# Altium schematic sheet [01] - CPU.SchDoc
size A3
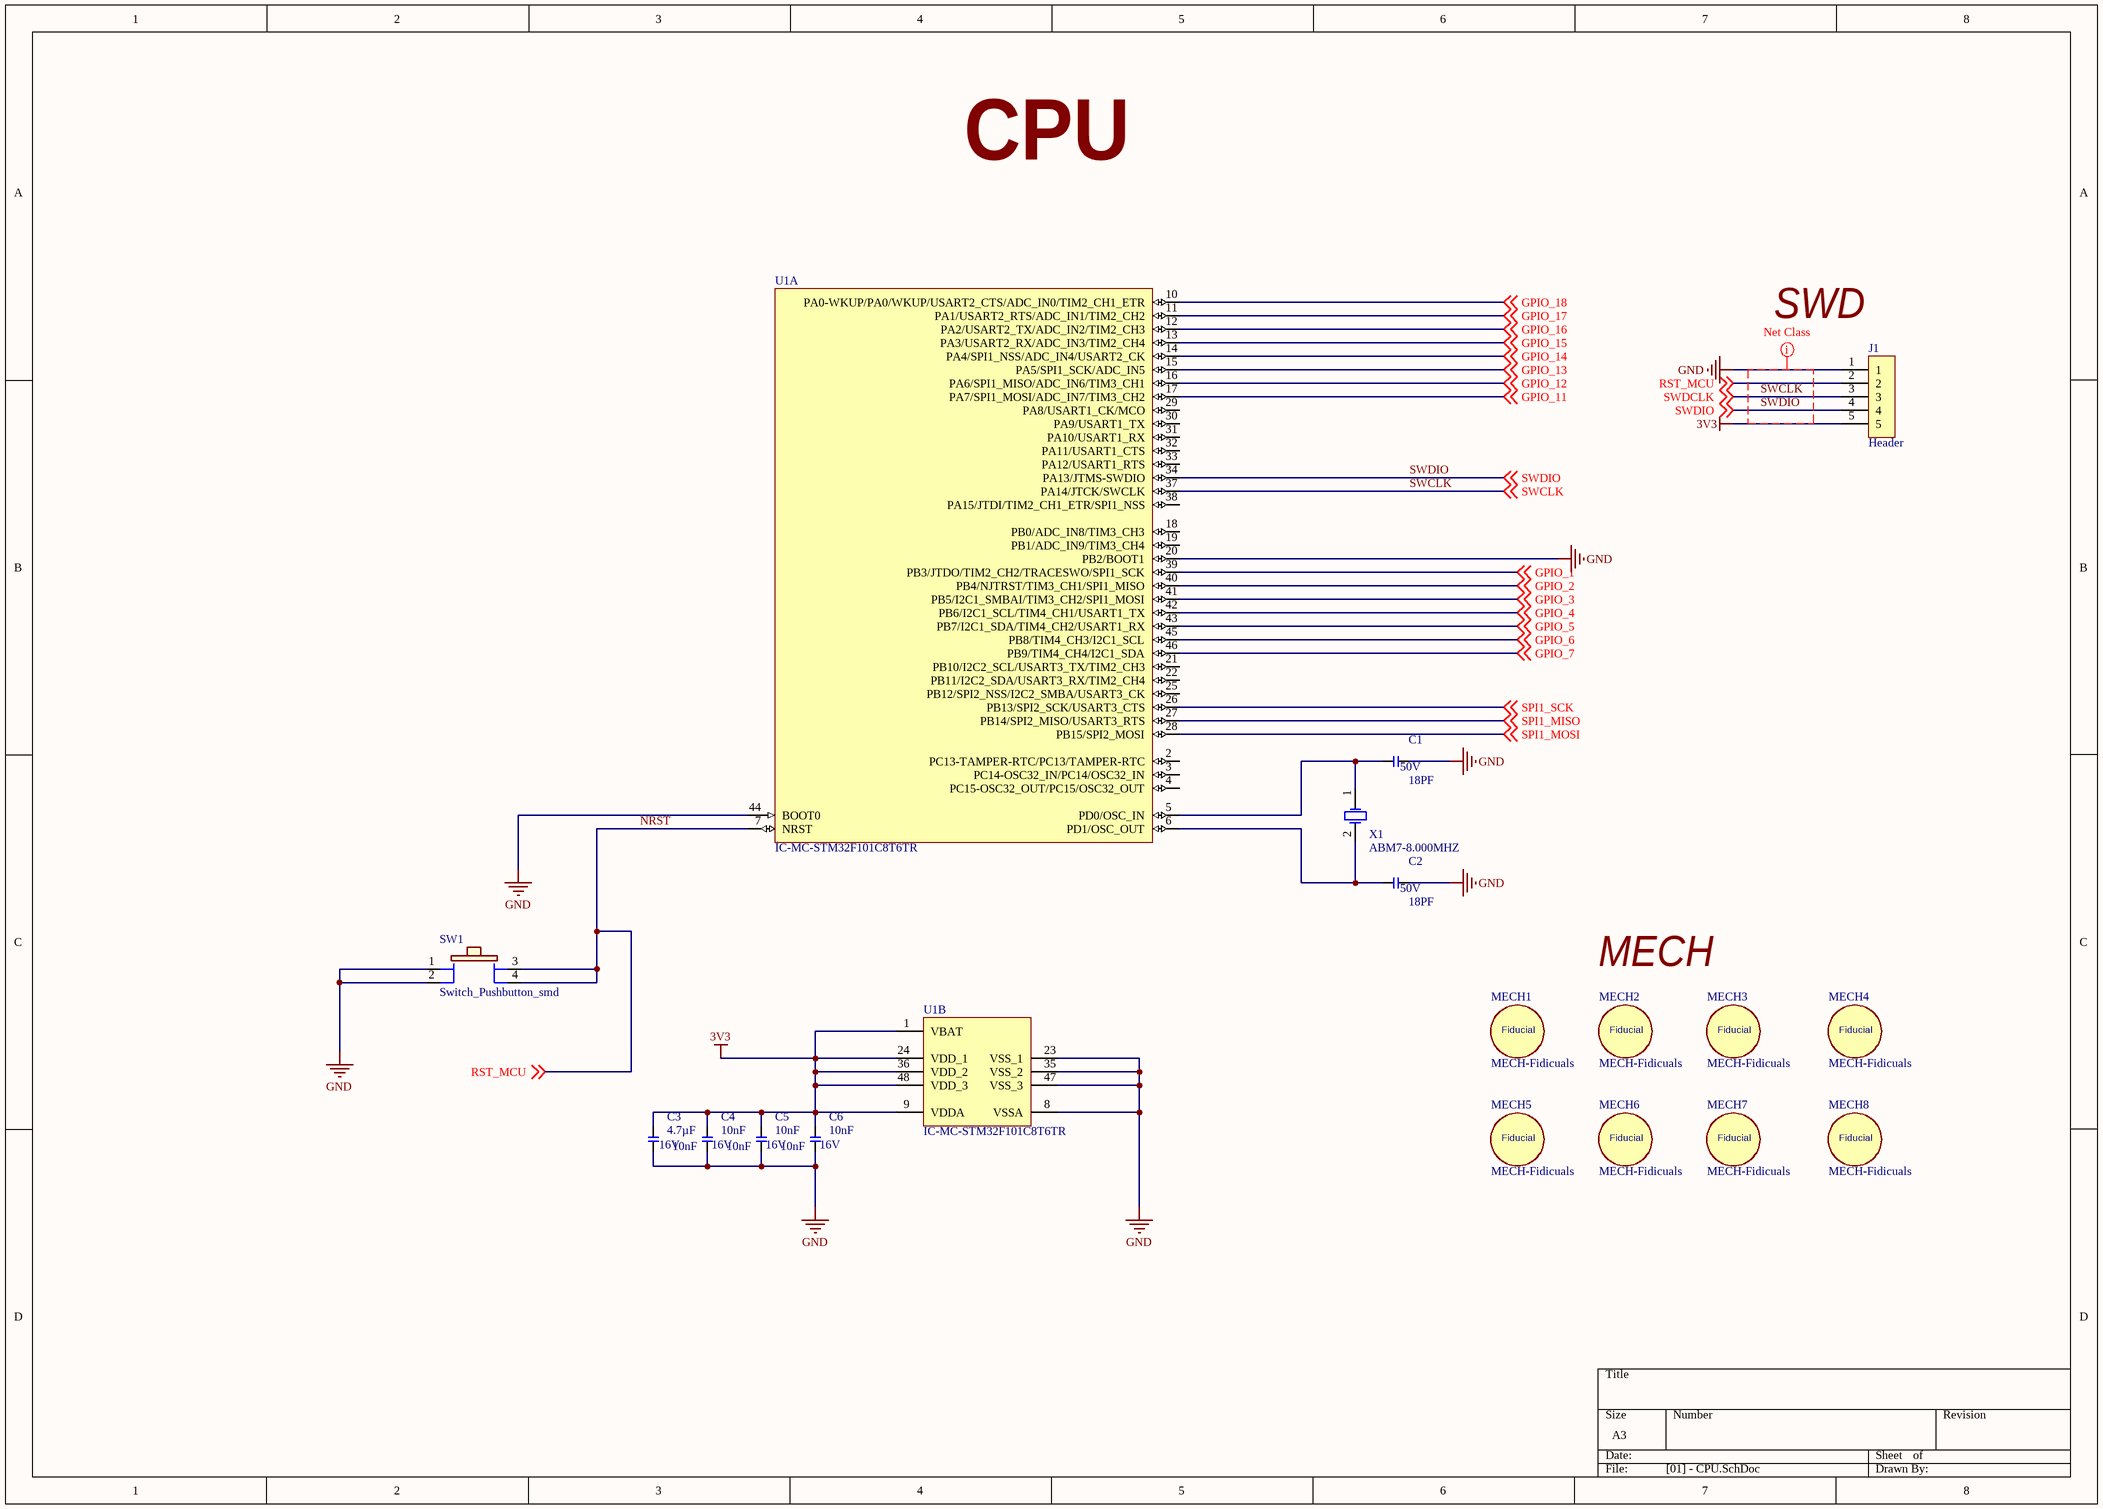
[diagram p0: [01] - CPU.SchDoc]

## Parts
C1  18PF  voltage_rating_dc: 50V  [C0805]
C2  18PF  voltage_rating_dc: 50V  [C0805]
C3  4.7µF  Voltage - Rated: 16V  [C0805]
C4  10nF  Voltage - Rated: 16V  [C0805]
C5  10nF  Voltage - Rated: 16V  [C0805]
C6  10nF  Voltage - Rated: 16V  [C0805]
J1  Header  [Header 1x5 2.54mm]
MECH1  MECH-Fidicuals  [T-Fidicuals]
MECH2  MECH-Fidicuals  [T-Fidicuals]
MECH3  MECH-Fidicuals  [T-Fidicuals]
MECH4  MECH-Fidicuals  [T-Fidicuals]
MECH5  MECH-Fidicuals  [T-Fidicuals]
MECH6  MECH-Fidicuals  [T-Fidicuals]
MECH7  MECH-Fidicuals  [T-Fidicuals]
MECH8  MECH-Fidicuals  [T-Fidicuals]
SW1  Switch_Pushbutton_smd  [SW_B3SL-1022P]
U1  IC-MC-STM32F101C8T6TR  [STM-LQFP48_M]  (parts A,B of 2)
X1  ABM7-8.000MHZ  [sm_osc_mixed]

## Nets
3V3: C3.2 C4.2 C5.2 C6.2 J1.5 U1.1(VBAT) U1.9(VDDA) U1.24(VDD_1) U1.36(VDD_2) U1.48(VDD_3)
GND: C1.2 C2.2 C3.1 C4.1 C5.1 C6.1 J1.1 SW1.1 SW1.2 U1.8(VSSA) U1.20(PB2/BOOT1) U1.23(VSS_1) U1.35(VSS_2) U1.44(BOOT0) U1.47(VSS_3)
GPIO_1: U1.39(PB3/JTDO/TIM2_CH2/TRACESWO/SPI1_SCK) ; off-sheet GPIO_1
GPIO_2: U1.40(PB4/NJTRST/TIM3_CH1/SPI1_MISO) ; off-sheet GPIO_2
GPIO_3: U1.41(PB5/I2C1_SMBAI/TIM3_CH2/SPI1_MOSI) ; off-sheet GPIO_3
GPIO_4: U1.42(PB6/I2C1_SCL/TIM4_CH1/USART1_TX) ; off-sheet GPIO_4
GPIO_5: U1.43(PB7/I2C1_SDA/TIM4_CH2/USART1_RX) ; off-sheet GPIO_5
GPIO_6: U1.45(PB8/TIM4_CH3/I2C1_SCL) ; off-sheet GPIO_6
GPIO_7: U1.46(PB9/TIM4_CH4/I2C1_SDA) ; off-sheet GPIO_7
GPIO_11: U1.17(PA7/SPI1_MOSI/ADC_IN7/TIM3_CH2) ; off-sheet GPIO_11
GPIO_12: U1.16(PA6/SPI1_MISO/ADC_IN6/TIM3_CH1) ; off-sheet GPIO_12
GPIO_13: U1.15(PA5/SPI1_SCK/ADC_IN5) ; off-sheet GPIO_13
GPIO_14: U1.14(PA4/SPI1_NSS/ADC_IN4/USART2_CK) ; off-sheet GPIO_14
GPIO_15: U1.13(PA3/USART2_RX/ADC_IN3/TIM2_CH4) ; off-sheet GPIO_15
GPIO_16: U1.12(PA2/USART2_TX/ADC_IN2/TIM2_CH3) ; off-sheet GPIO_16
GPIO_17: U1.11(PA1/USART2_RTS/ADC_IN1/TIM2_CH2) ; off-sheet GPIO_17
GPIO_18: U1.10(PA0-WKUP/PA0/WKUP/USART2_CTS/ADC_IN0/TIM2_CH1_ETR) ; off-sheet GPIO_18
NRST: J1.2 SW1.3 SW1.4 U1.7(NRST) ; off-sheet RST_MCU  [also labelled RST_MCU]
SPI1_MISO: U1.27(PB14/SPI2_MISO/USART3_RTS) ; off-sheet SPI1_MISO
SPI1_MOSI: U1.28(PB15/SPI2_MOSI) ; off-sheet SPI1_MOSI
SPI1_SCK: U1.26(PB13/SPI2_SCK/USART3_CTS) ; off-sheet SPI1_SCK
SWCLK: J1.3 U1.37(PA14/JTCK/SWCLK) ; off-sheet SWCLK, off-sheet SWDCLK  [also labelled SWDCLK]
SWDIO: J1.4 U1.34(PA13/JTMS-SWDIO) ; off-sheet SWDIO
NetC1_1: C1.1 U1.5(PD0/OSC_IN) X1.1(OSC1)
NetC2_1: C2.1 U1.6(PD1/OSC_OUT) X1.2(OSC2)

Not connected (* = marked no-connect by the designer): U1 2(PC13-TAMPER-RTC/PC13/TAMPER-RTC) 3(PC14-OSC32_IN/PC14/OSC32_IN) 4(PC15-OSC32_OUT/PC15/OSC32_OUT) 18(PB0/ADC_IN8/TIM3_CH3) 19(PB1/ADC_IN9/TIM3_CH4) 21(PB10/I2C2_SCL/USART3_TX/TIM2_CH3) 22(PB11/I2C2_SDA/USART3_RX/TIM2_CH4) 25(PB12/SPI2_NSS/I2C2_SMBA/USART3_CK) 29(PA8/USART1_CK/MCO) 30(PA9/USART1_TX) 31(PA10/USART1_RX) 32(PA11/USART1_CTS) 33(PA12/USART1_RTS) 38(PA15/JTDI/TIM2_CH1_ETR/SPI1_NSS)

## Layout directives
net class SWD: GND

## Notes on the sheet
- CPU
- (near J1) SWD
- MECH
- (in symbol MECH-Fidicuals) Fiducial

## Library data of the parts
C1 C2 = C-18PF,50V,0805: MULTICOMP - MC0805N180J500CT - CAP, MLCC, C0G/NP0, 18PF, 50V,0805, REEL; capacitance_tolerance: ±5%; pin_count: 2; Supplier 1: Octopart; Manufacturer: Multicomp; Manufacturer Part Number: MC0805N180J500CT; Pricing 1: 1=0.11400, 10=0.07300, 50=0.04100, 100=0.03200, 250=0.02600, 500=0.02200, 1000=0.01800 (USD); capacitance: 18PF; ComponentLink1URL: http://datasheet.octopart.com/MC0805N180J500CT-Multicomp-datasheet-16478625.pdf; ComponentLink1Description: http://datasheet.octopart.com/MC0805N180J500CT-Multicomp-datasheet-16478625.pdf; Supplier Part Number 1: Newark - 06R4039; Stock 1: 3187; reach_svhc_compliance: No SVHC; rohs_status: Compliant; dielectric_characteristic: C0G/NP0; Octopart Url: http://octopart.com/mc0805n180j500ct-multicomp-10529169; Seller Landing  Url: https://octopart-clicks.com/click/track?country=TR&ak=8157f166&sig=03c9fd1&sid=2402&ppid=10529169&vpid=17760821&ct=offers; OctopartID: 811748bd0de05ed0; ComponentLink2URL: http://datasheet.octopart.com/MC0805N180J500CT-Multicomp-datasheet-22150886.pdf; ComponentLink2Description: http://datasheet.octopart.com/MC0805N180J500CT-Multicomp-datasheet-22150886.pdf; ComponentLink3URL: http://datasheet.octopart.com/MC0805N180J500CT-Multicomp-datasheet-8445804.pdf; ComponentLink3Description: http://datasheet.octopart.com/MC0805N180J500CT-Multicomp-datasheet-8445804.pdf; ComponentLink4URL: http://datasheet.octopart.com/MC0805N180J500CT-Multicomp-datasheet-34215986.pdf; ComponentLink4Description: http://datasheet.octopart.com/MC0805N180J500CT-Multicomp-datasheet-34215986.pdf; ComponentLink5URL: http://datasheet.octopart.com/MC0805N180J500CT-Multicomp-datasheet-26590290.pdf; ComponentLink5Description: http://datasheet.octopart.com/MC0805N180J500CT-Multicomp-datasheet-26590290.pdf; ComponentLink6URL: http://datasheet.octopart.com/MC0805N180J500CT-Multicomp-datasheet-15500401.pdf; ComponentLink6Description: http://datasheet.octopart.com/MC0805N180J500CT-Multicomp-datasheet-15500401.pdf; ComponentLink7URL: http://datasheet.octopart.com/MC0805N180J500CT-Multicomp-datasheet-10838970.pdf; ComponentLink7Description: http://datasheet.octopart.com/MC0805N180J500CT-Multicomp-datasheet-10838970.pdf
C3 = C-4.7UF,16V,0805: AVX - 0805YC475KAT2A - CAP, MLCC, X7R, 4.7UF, 16V, 0805; Manufacturer: AVX Corporation; Tolerance: ±10%; Supplier 1: Digi-Key; Manufacturer Part Number: 0805YC475KAT2A; RoHS: RoHS Compliant; Stock 1: 16611; Pricing 1: 1=0.78, 10=0.578, 25=0.4952, 50=0.462, 100=0.396, 250=0.363, 500=0.3135, 1000=0.264 (USD); Capacitance: 4.7µF; Packaging: Cut Tape (CT); ComponentLink1URL: http://datasheets.avx.com/X7RDielectric.pdf; ComponentLink1Description: http://datasheets.avx.com/X7RDielectric.pdf; Supplier Part Number 1: 478-5722-1-ND; Category: Capacitors; Temperature Coefficient: X7R; Mounting Type: Surface Mount, MLCC; Operating Temperature: -55°C ~ 125°C; Applications: General Purpose; Ratings: -; Package / Case: 0805 (2012 Metric); Size / Dimension: 0.079" L x 0.049" W (2.01mm x 1.25mm); Height - Seated (Max): -; Thickness (Max): 0.060" (1.52mm); Lead Spacing: -; Features: -; Lead Style: -
C4-C6 = C-10NF,16V,0805: CAP CER 10000PF 16V NP0 0805; Manufacturer: AVX Corporation; Manufacturer Part Number: 0805YA103JAT2A; Tolerance: ±5%; Temperature Coefficient: C0G, NP0; Supplier 1: Digi-Key; RoHS: RoHS Compliant; Stock 1: 28062; Pricing 1: 1=0.29, 10=0.204, 25=0.1668, 50=0.1424, 100=0.1221, 250=0.10176, 500=0.09158, 1000=0.07733 (USD); ComponentLink1URL: http://datasheets.avx.com/C0GNP0-Dielectric.pdf; ComponentLink1Description: http://datasheets.avx.com/C0GNP0-Dielectric.pdf; Supplier Part Number 1: 478-1334-1-ND; Category: Capacitors; Packaging: Cut Tape (CT); Mounting Type: Surface Mount, MLCC; Operating Temperature: -55°C ~ 125°C; Applications: General Purpose; Ratings: -; Package / Case: 0805 (2012 Metric); Size / Dimension: 0.079" L x 0.049" W (2.01mm x 1.25mm); Height - Seated (Max): -; Thickness (Max): 0.037" (0.94mm); Lead Spacing: -; Features: -; Lead Style: -; Capacitance: 10nF
J1 = CON-Header 1X5 2.54MM: Header 1X5 2.54
MECH1-MECH8 = MECH-Fidicuals: Fidicuals
SW1 = Switch_Pushbutton_smd: Switch Push Button tactile; TIIntPartnumber: 2W0018; MfrNum: B3SL-1022P; Mfr: Omron; PartName: SwitchPushMomTactilesmd; Cost10K: 0.25; Cost100: 0.340; Vendor: Digikey; DescriptiveText: Switch Push Button tactile; Descriptive_Text: Switch Push Button tactile
U1 = IC-MC-STM32F101C8T6TR: IC MCU 32BIT 64KB FLASH 48LQFP; Manufacturer: STMicroelectronics; Program Memory Size: 64KB (64K x 8); Core Processor: ARM® Cortex®-M3; Core Size: 32-Bit; Speed: 36MHz; Connectivity: I²C, IrDA, LIN, SPI, UART/USART; Peripherals: DMA, PDR, POR, PVD, PWM, Temp Sensor, WDT; Number of I/O: 37; RAM Size: 10K x 8; Voltage - Supply (Vcc/Vdd): 2 V ~ 3.6 V; Data Converters: A/D 10x12b; Oscillator Type: Internal; Supplier 1: Digi-Key; Manufacturer Part Number: STM32F101C8T6TR; RoHS: RoHS Compliant; Category: Integrated Circuits (ICs); Stock 1: 0; Pricing 1: 2400=2.46449 (USD); Packaging: Tape & Reel (TR); Program Memory Type: FLASH; ComponentLink1URL: http://www.st.com/content/ccc/resource/technical/document/datasheet/6b/28/4e/ce/a7/d3/42/8d/CD00161561.pdf/files/CD00161561.pdf/jcr:content/translations/en.CD00161561.pdf; ComponentLink1Description: http://www.st.com/content/ccc/resource/technical/document/datasheet/6b/28/4e/ce/a7/d3/42/8d/CD00161561.pdf/files/CD00161561.pdf/jcr:content/translations/en.CD00161561.pdf; Supplier Part Number 1: STM32F101C8T6TR-ND; EEPROM Size: -; Operating Temperature: -40°C ~ 85°C (TA); Package / Case: 48-LQFP; Supplier Device Package: 48-LQFP (7x7)
X1 = OSC-ABM7-8.000MHZ-D2Y-T: CRYSTAL 8.0000MHZ 18PF SMD; Manufacturer: Abracon LLC; Frequency: 8MHz; Frequency Stability: ±30ppm; Frequency Tolerance: ±20ppm; ESR (Equivalent Series Resistance): 100 Ohm; Operating Mode: Fundamental; Supplier 1: Digi-Key; Manufacturer Part Number: ABM7-8.000MHZ-D2Y-T; RoHS: RoHS Compliant; Category: Crystals and Oscillators; Stock 1: 111842; Pricing 1: 1=0.76, 10=0.678, 50=0.6328, 100=0.56, 500=0.5292 (USD); Packaging: Cut Tape (CT); Type: MHz Crystal; Load Capacitance: 18pF; Operating Temperature: -40°C ~ 85°C; Ratings: -; Mounting Type: Surface Mount; Package / Case: 2-SMD, No Lead (DFN, LCC); Size / Dimension: 0.236" L x 0.138" W (6.00mm x 3.50mm); Height: 0.055" (1.40mm); ComponentLink1URL: http://www.abracon.com/Resonators/abm7.pdf; ComponentLink1Description: http://www.abracon.com/Resonators/abm7.pdf; Supplier Part Number 1: 535-9831-1-ND